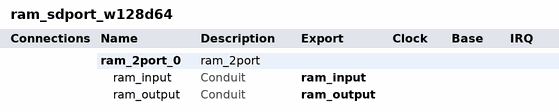
[diagram p0: system contents]
# Platform Designer (Qsys) system ram_sdport_w128d64, Arria 10 10AX048H2F34E2SG
# Parameters at their usual value, and those the tool derives, are not listed.
package require qsys
create_system ram_sdport_w128d64
set_project_property DEVICE_FAMILY {Arria 10}
set_project_property DEVICE 10AX048H2F34E2SG

add_instance ram_2port_0 ram_2port 19.1
set_instance_property ram_2port_0 AUTO_EXPORT true
set_instance_parameter_value ram_2port_0 GUI_ACLR_READ_INPUT_RDADDRESS false
set_instance_parameter_value ram_2port_0 GUI_ACLR_READ_OUTPUT_QA false
set_instance_parameter_value ram_2port_0 GUI_ACLR_READ_OUTPUT_QB false
set_instance_parameter_value ram_2port_0 GUI_BLANK_MEMORY 0
set_instance_parameter_value ram_2port_0 GUI_BYTE_ENABLE_A false
set_instance_parameter_value ram_2port_0 GUI_BYTE_ENABLE_B false
set_instance_parameter_value ram_2port_0 GUI_BYTE_ENABLE_WIDTH 8
set_instance_parameter_value ram_2port_0 GUI_CLKEN_ADDRESS_STALL_A false
set_instance_parameter_value ram_2port_0 GUI_CLKEN_ADDRESS_STALL_B false
set_instance_parameter_value ram_2port_0 GUI_CLKEN_INPUT_REG_A false
set_instance_parameter_value ram_2port_0 GUI_CLKEN_INPUT_REG_B false
set_instance_parameter_value ram_2port_0 GUI_CLKEN_OUTPUT_REG_A false
set_instance_parameter_value ram_2port_0 GUI_CLKEN_OUTPUT_REG_B false
set_instance_parameter_value ram_2port_0 GUI_CLKEN_RDADDRESSSTALL false
set_instance_parameter_value ram_2port_0 GUI_CLKEN_READ_INPUT_REG false
set_instance_parameter_value ram_2port_0 GUI_CLKEN_READ_OUTPUT_REG false
set_instance_parameter_value ram_2port_0 GUI_CLKEN_WRADDRESSSTALL false
set_instance_parameter_value ram_2port_0 GUI_CLKEN_WRITE_INPUT_REG false
set_instance_parameter_value ram_2port_0 GUI_CLOCK_TYPE 0
set_instance_parameter_value ram_2port_0 GUI_COHERENT_READ false
set_instance_parameter_value ram_2port_0 GUI_CONSTRAINED_DONT_CARE true
set_instance_parameter_value ram_2port_0 GUI_DATAA_WIDTH 128
set_instance_parameter_value ram_2port_0 GUI_DIFFERENT_CLKENS false
set_instance_parameter_value ram_2port_0 GUI_ECCENCBYPASS false
set_instance_parameter_value ram_2port_0 GUI_ECC_DOUBLE false
set_instance_parameter_value ram_2port_0 GUI_ECC_PIPELINE false
set_instance_parameter_value ram_2port_0 GUI_ECC_TRIPLE false
set_instance_parameter_value ram_2port_0 GUI_FILE_REFERENCE 0
set_instance_parameter_value ram_2port_0 GUI_FORCE_TO_ZERO false
set_instance_parameter_value ram_2port_0 GUI_INIT_FILE_LAYOUT PORT_B
set_instance_parameter_value ram_2port_0 GUI_INIT_SIM_TO_X false
set_instance_parameter_value ram_2port_0 GUI_LC_IMPLEMENTION_OPTIONS 0
set_instance_parameter_value ram_2port_0 GUI_MAX_DEPTH Auto
set_instance_parameter_value ram_2port_0 GUI_MEMSIZE_BITS 256
set_instance_parameter_value ram_2port_0 GUI_MEMSIZE_WORDS 64
set_instance_parameter_value ram_2port_0 GUI_MEM_IN_BITS 0
set_instance_parameter_value ram_2port_0 GUI_MODE 0
set_instance_parameter_value ram_2port_0 GUI_NBE_A true
set_instance_parameter_value ram_2port_0 GUI_NBE_B true
set_instance_parameter_value ram_2port_0 GUI_QA_WIDTH 128
set_instance_parameter_value ram_2port_0 GUI_QB_WIDTH 128
set_instance_parameter_value ram_2port_0 GUI_Q_PORT_MODE 2
set_instance_parameter_value ram_2port_0 GUI_RAM_BLOCK_TYPE Auto
set_instance_parameter_value ram_2port_0 GUI_RDEN_DOUBLE false
set_instance_parameter_value ram_2port_0 GUI_RDEN_SINGLE true
set_instance_parameter_value ram_2port_0 GUI_RDW_A_MODE {New Data}
set_instance_parameter_value ram_2port_0 GUI_RDW_B_MODE {New Data}
set_instance_parameter_value ram_2port_0 GUI_READ_INPUT_RDADDRESS true
set_instance_parameter_value ram_2port_0 GUI_READ_OUTPUT_QA true
set_instance_parameter_value ram_2port_0 GUI_READ_OUTPUT_QB true
set_instance_parameter_value ram_2port_0 GUI_SCLR_READ_OUTPUT_QA false
set_instance_parameter_value ram_2port_0 GUI_SCLR_READ_OUTPUT_QB false
set_instance_parameter_value ram_2port_0 GUI_TBENCH false
set_instance_parameter_value ram_2port_0 GUI_VAR_WIDTH false
set_instance_parameter_value ram_2port_0 GUI_WIDTH_ECCENCPARITY 8
set_instance_parameter_value ram_2port_0 GUI_WRITE_INPUT_PORTS true

# exported interfaces
add_interface ram_input conduit end
set_interface_property ram_input EXPORT_OF ram_2port_0.ram_input
add_interface ram_output conduit end
set_interface_property ram_output EXPORT_OF ram_2port_0.ram_output

set_interconnect_requirement {$system} qsys_mm.clockCrossingAdapter HANDSHAKE
set_interconnect_requirement {$system} qsys_mm.enableEccProtection FALSE
set_interconnect_requirement {$system} qsys_mm.insertDefaultSlave FALSE
set_interconnect_requirement {$system} qsys_mm.maxAdditionalLatency 1

save_system ram_sdport_w128d64.qsys
